# Altium schematic sheet LVDS PHY.SchDoc
size A3
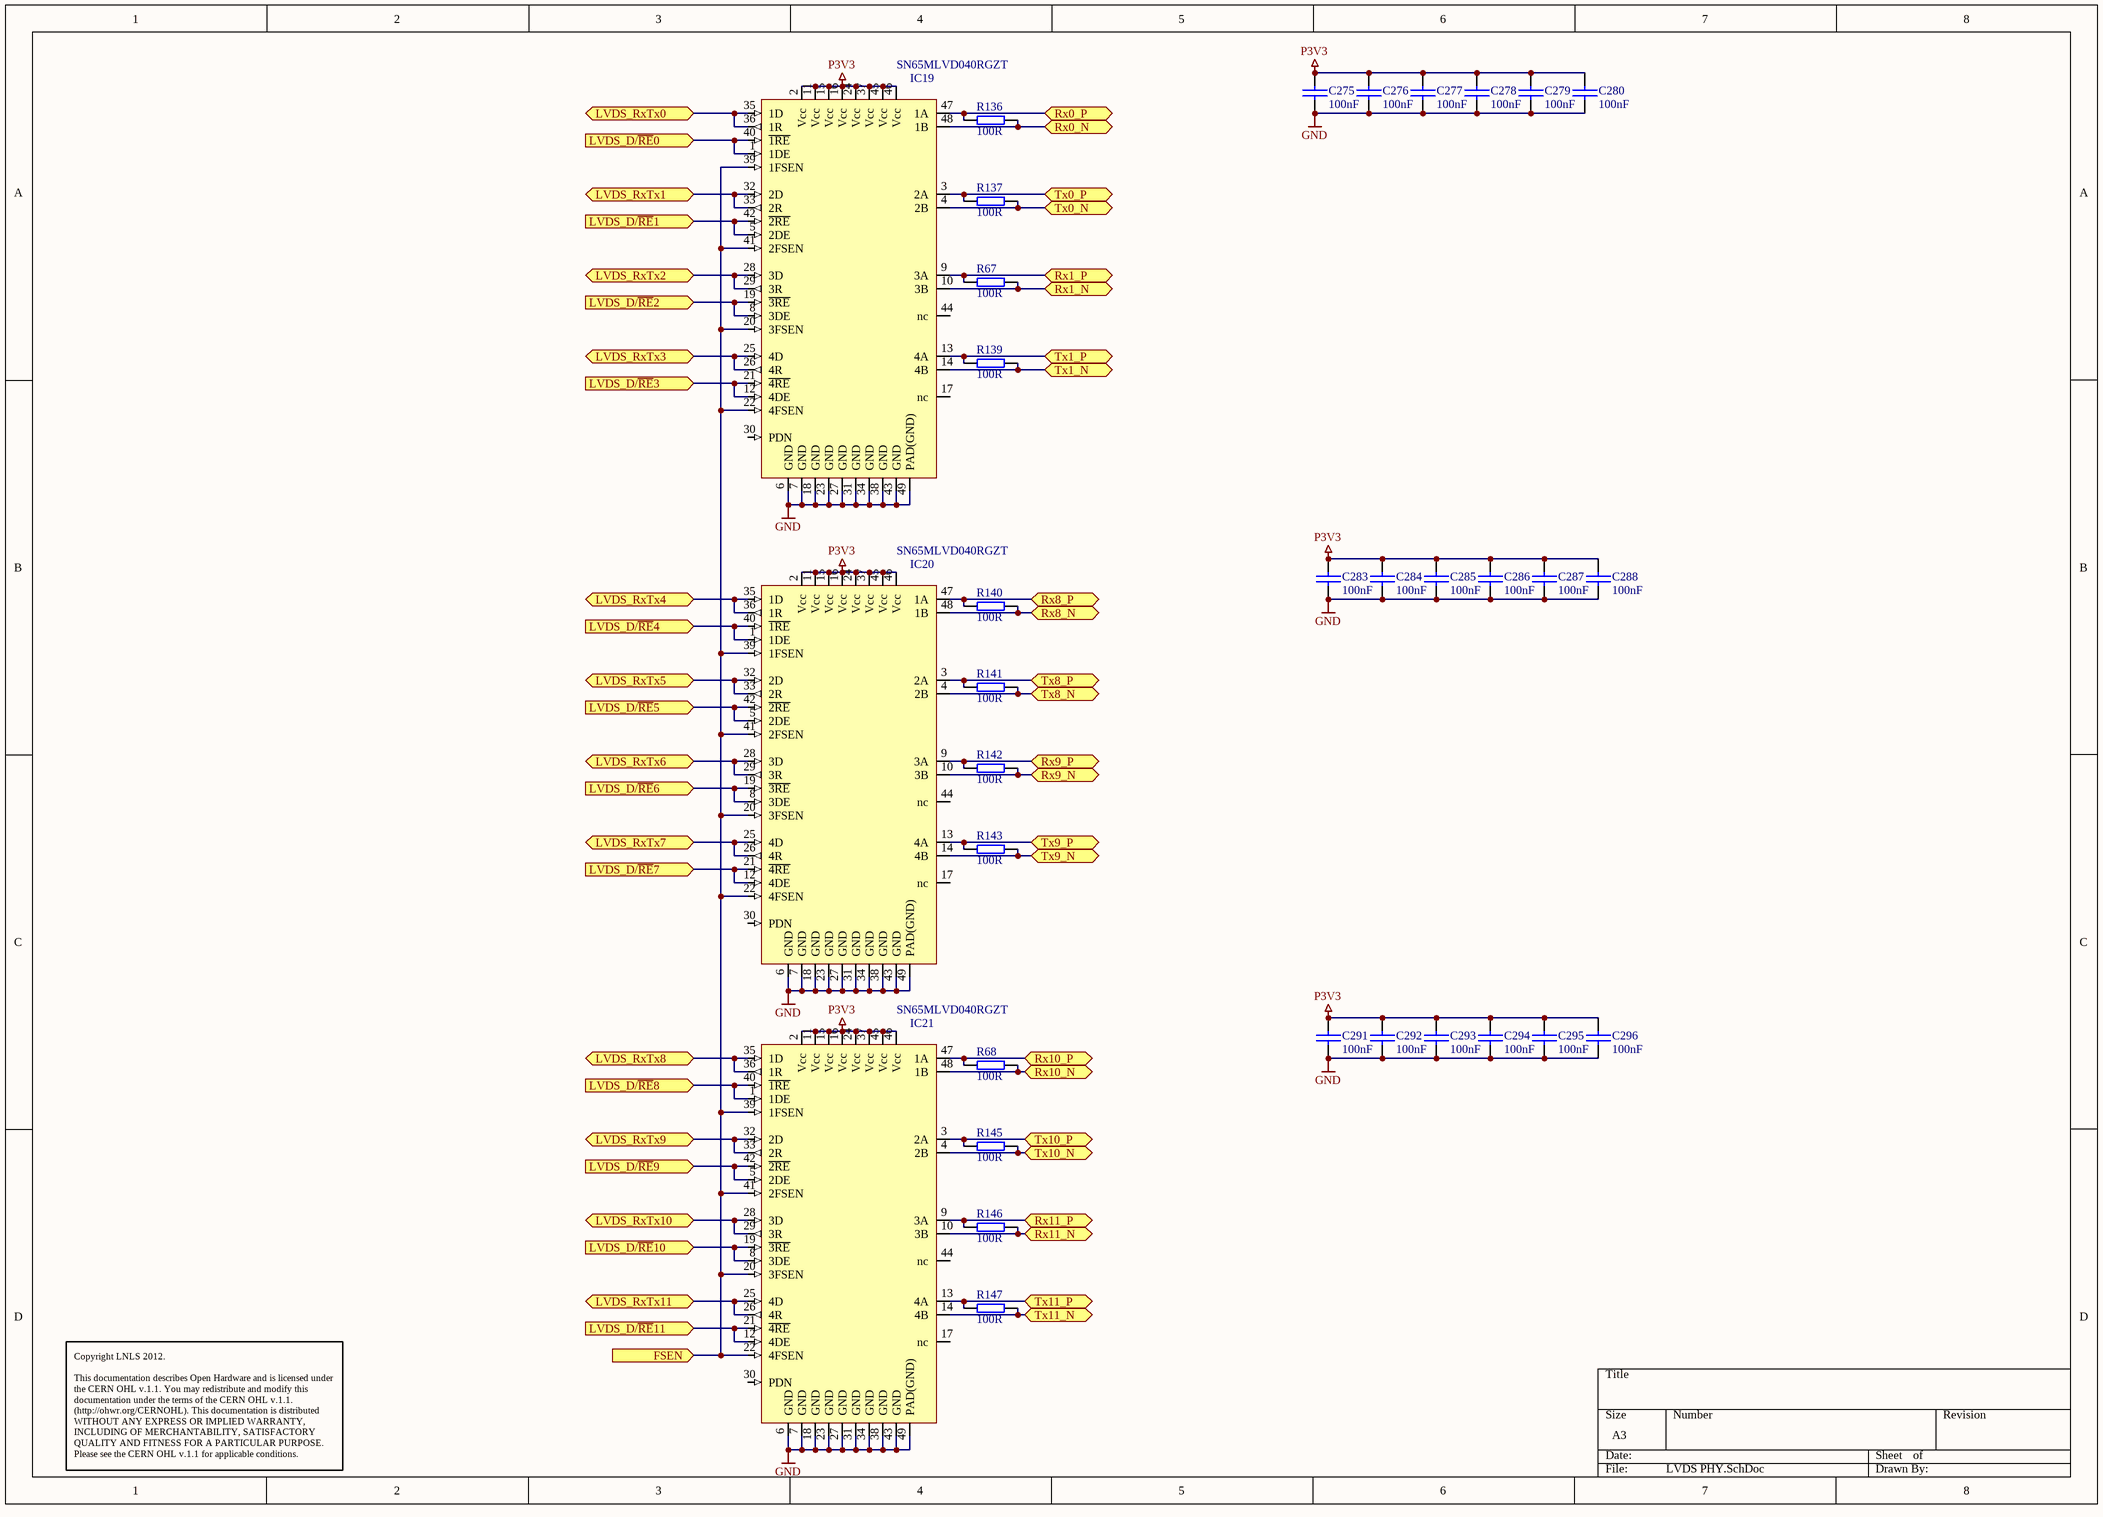
[diagram p0: LVDS PHY.SchDoc]

## Parts
C275  100nF  [0201C]
C276  100nF  [0201C]
C277  100nF  [0201C]
C278  100nF  [0201C]
C279  100nF  [0201C]
C280  100nF  [0201C]
C283  100nF  [0201C]
C284  100nF  [0201C]
C285  100nF  [0201C]
C286  100nF  [0201C]
C287  100nF  [0201C]
C288  100nF  [0201C]
C291  100nF  [0201C]
C292  100nF  [0201C]
C293  100nF  [0201C]
C294  100nF  [0201C]
C295  100nF  [0201C]
C296  100nF  [0201C]
IC19  SN65MLVD040RGZT  [QFN48L]
IC20  SN65MLVD040RGZT  [QFN48L]
IC21  SN65MLVD040RGZT  [QFN48L]
R67  100R  [0402R]
R68  100R  [0402R]
R136  100R  [0402R]
R137  100R  [0402R]
R139  100R  [0402R]
R140  100R  [0402R]
R141  100R  [0402R]
R142  100R  [0402R]
R143  100R  [0402R]
R145  100R  [0402R]
R146  100R  [0402R]
R147  100R  [0402R]

## Ports
FSEN (in), LVDS_D/~{RE}0 (in), LVDS_D/~{RE}1 (in), LVDS_D/~{RE}2 (in), LVDS_D/~{RE}3 (in), LVDS_D/~{RE}4 (in), LVDS_D/~{RE}5 (in), LVDS_D/~{RE}6 (in), LVDS_D/~{RE}7 (in), LVDS_D/~{RE}8 (in), LVDS_D/~{RE}9 (in), LVDS_D/~{RE}10 (in), LVDS_D/~{RE}11 (in), LVDS_RxTx0 (bidir), LVDS_RxTx1 (bidir), LVDS_RxTx2 (bidir), LVDS_RxTx3 (bidir), LVDS_RxTx4 (bidir), LVDS_RxTx5 (bidir), LVDS_RxTx6 (bidir), LVDS_RxTx7 (bidir), LVDS_RxTx8 (bidir), LVDS_RxTx9 (bidir), LVDS_RxTx10 (bidir), LVDS_RxTx11 (bidir), Rx0_N (bidir), Rx0_P (bidir), Rx1_N (bidir), Rx1_P (bidir), Rx8_N (bidir), Rx8_P (bidir), Rx9_N (bidir), Rx9_P (bidir), Rx10_N (bidir), Rx10_P (bidir), Rx11_N (bidir), Rx11_P (bidir), Tx0_N (bidir), Tx0_P (bidir), Tx1_N (bidir), Tx1_P (bidir), Tx8_N (bidir), Tx8_P (bidir), Tx9_N (bidir), Tx9_P (bidir), Tx10_N (bidir), Tx10_P (bidir), Tx11_N (bidir), Tx11_P (bidir)

## Nets
GND: C275.2 C276.2 C277.2 C278.2 C279.2 C280.2 C283.2 C284.2 C285.2 C286.2 C287.2 C288.2 C291.2 C292.2 C293.2 C294.2 C295.2 C296.2 IC19.6(GND) IC19.7(GND) IC19.18(GND) IC19.23(GND) IC19.27(GND) IC19.31(GND) IC19.34(GND) IC19.38(GND) IC19.43(GND) IC19.49(PAD(GND)) IC20.6(GND) IC20.7(GND) IC20.18(GND) IC20.23(GND) IC20.27(GND) IC20.31(GND) IC20.34(GND) IC20.38(GND) IC20.43(GND) IC20.49(PAD(GND)) IC21.6(GND) IC21.7(GND) IC21.18(GND) IC21.23(GND) IC21.27(GND) IC21.31(GND) IC21.34(GND) IC21.38(GND) IC21.43(GND) IC21.49(PAD(GND))
P3V3: C275.1 C276.1 C277.1 C278.1 C279.1 C280.1 C283.1 C284.1 C285.1 C286.1 C287.1 C288.1 C291.1 C292.1 C293.1 C294.1 C295.1 C296.1 IC19.2(Vcc) IC19.11(Vcc) IC19.15(Vcc) IC19.16(Vcc) IC19.24(Vcc) IC19.37(Vcc) IC19.45(Vcc) IC19.46(Vcc) IC20.2(Vcc) IC20.11(Vcc) IC20.15(Vcc) IC20.16(Vcc) IC20.24(Vcc) IC20.37(Vcc) IC20.45(Vcc) IC20.46(Vcc) IC21.2(Vcc) IC21.11(Vcc) IC21.15(Vcc) IC21.16(Vcc) IC21.24(Vcc) IC21.37(Vcc) IC21.45(Vcc) IC21.46(Vcc)
FSEN: IC19.20(3FSEN) IC19.22(4FSEN) IC19.39(1FSEN) IC19.41(2FSEN) IC20.20(3FSEN) IC20.22(4FSEN) IC20.39(1FSEN) IC20.41(2FSEN) IC21.20(3FSEN) IC21.22(4FSEN) IC21.39(1FSEN) IC21.41(2FSEN) ; port FSEN
LVDS_D/~{RE}0: IC19.1(1DE) IC19.40(~{1RE}) ; port LVDS_D/~{RE}0
LVDS_D/~{RE}1: IC19.5(2DE) IC19.42(~{2RE}) ; port LVDS_D/~{RE}1
LVDS_D/~{RE}2: IC19.8(3DE) IC19.19(~{3RE}) ; port LVDS_D/~{RE}2
LVDS_D/~{RE}3: IC19.12(4DE) IC19.21(~{4RE}) ; port LVDS_D/~{RE}3
LVDS_D/~{RE}4: IC20.1(1DE) IC20.40(~{1RE}) ; port LVDS_D/~{RE}4
LVDS_D/~{RE}5: IC20.5(2DE) IC20.42(~{2RE}) ; port LVDS_D/~{RE}5
LVDS_D/~{RE}6: IC20.8(3DE) IC20.19(~{3RE}) ; port LVDS_D/~{RE}6
LVDS_D/~{RE}7: IC20.12(4DE) IC20.21(~{4RE}) ; port LVDS_D/~{RE}7
LVDS_D/~{RE}8: IC21.1(1DE) IC21.40(~{1RE}) ; port LVDS_D/~{RE}8
LVDS_D/~{RE}9: IC21.5(2DE) IC21.42(~{2RE}) ; port LVDS_D/~{RE}9
LVDS_D/~{RE}10: IC21.8(3DE) IC21.19(~{3RE}) ; port LVDS_D/~{RE}10
LVDS_D/~{RE}11: IC21.12(4DE) IC21.21(~{4RE}) ; port LVDS_D/~{RE}11
LVDS_RxTx0: IC19.35(1D) IC19.36(1R) ; port LVDS_RxTx0
LVDS_RxTx1: IC19.32(2D) IC19.33(2R) ; port LVDS_RxTx1
LVDS_RxTx2: IC19.28(3D) IC19.29(3R) ; port LVDS_RxTx2
LVDS_RxTx3: IC19.25(4D) IC19.26(4R) ; port LVDS_RxTx3
LVDS_RxTx4: IC20.35(1D) IC20.36(1R) ; port LVDS_RxTx4
LVDS_RxTx5: IC20.32(2D) IC20.33(2R) ; port LVDS_RxTx5
LVDS_RxTx6: IC20.28(3D) IC20.29(3R) ; port LVDS_RxTx6
LVDS_RxTx7: IC20.25(4D) IC20.26(4R) ; port LVDS_RxTx7
LVDS_RxTx8: IC21.35(1D) IC21.36(1R) ; port LVDS_RxTx8
LVDS_RxTx9: IC21.32(2D) IC21.33(2R) ; port LVDS_RxTx9
LVDS_RxTx10: IC21.28(3D) IC21.29(3R) ; port LVDS_RxTx10
LVDS_RxTx11: IC21.25(4D) IC21.26(4R) ; port LVDS_RxTx11
Rx0_N: IC19.48(1B) R136.2 ; port Rx0_N
Rx0_P: IC19.47(1A) R136.1 ; port Rx0_P
Rx1_N: IC19.10(3B) R67.2 ; port Rx1_N
Rx1_P: IC19.9(3A) R67.1 ; port Rx1_P
Rx8_N: IC20.48(1B) R140.2 ; port Rx8_N
Rx8_P: IC20.47(1A) R140.1 ; port Rx8_P
Rx9_N: IC20.10(3B) R142.2 ; port Rx9_N
Rx9_P: IC20.9(3A) R142.1 ; port Rx9_P
Rx10_N: IC21.48(1B) R68.2 ; port Rx10_N
Rx10_P: IC21.47(1A) R68.1 ; port Rx10_P
Rx11_N: IC21.10(3B) R146.2 ; port Rx11_N
Rx11_P: IC21.9(3A) R146.1 ; port Rx11_P
Tx0_N: IC19.4(2B) R137.2 ; port Tx0_N
Tx0_P: IC19.3(2A) R137.1 ; port Tx0_P
Tx1_N: IC19.14(4B) R139.2 ; port Tx1_N
Tx1_P: IC19.13(4A) R139.1 ; port Tx1_P
Tx8_N: IC20.4(2B) R141.2 ; port Tx8_N
Tx8_P: IC20.3(2A) R141.1 ; port Tx8_P
Tx9_N: IC20.14(4B) R143.2 ; port Tx9_N
Tx9_P: IC20.13(4A) R143.1 ; port Tx9_P
Tx10_N: IC21.4(2B) R145.2 ; port Tx10_N
Tx10_P: IC21.3(2A) R145.1 ; port Tx10_P
Tx11_N: IC21.14(4B) R147.2 ; port Tx11_N
Tx11_P: IC21.13(4A) R147.1 ; port Tx11_P

Not connected (* = marked no-connect by the designer): IC19 17(nc) 30(PDN) 44(nc); IC20 17(nc) 30(PDN) 44(nc); IC21 17(nc) 30(PDN) 44(nc)

## Notes on the sheet
- Copyright LNLS 2012.
  This documentation describes Open Hardware and is licensed under the CERN OHL v.1.1. You may redistribute and modify this documentation under the terms of the CERN OHL v.1.1. (http://ohwr.org/CERNOHL). This documentation is distributed WITHOUT ANY EXPRESS OR IMPLIED WARRANTY, INCLUDING OF MERCHANTABILITY, SATISFACTORY QUALITY AND FITNESS FOR A PARTICULAR PURPOSE. Please see the CERN OHL v.1.1 for applicable conditions.

## Library data of the parts
C275-C280 C283-C288 C291-C296 = CAP_SMD_0201: Capacitor SMD
IC19-IC21 = IFC_SN65MLVD040
R67 R68 R136 R137 R139-R143 R145-R147 = RES_0402: SMD Resistor; Supplier 1: Newark; Supplier Part Number 1: 59M6691